# Altium schematic sheet Programmer.SchDoc
size A
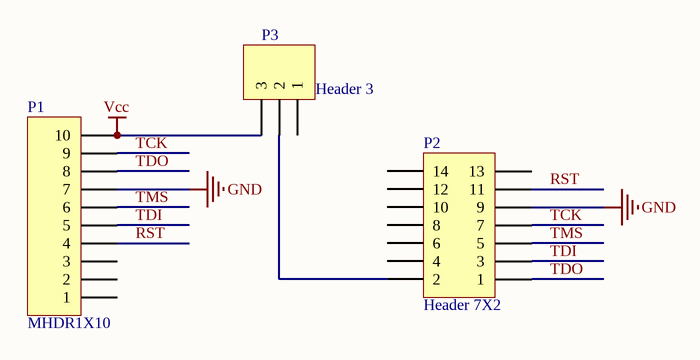
[diagram p0: Programmer.SchDoc]

## Parts
P1  MHDR1X10  [MHDR1X10]
P2  Header 7X2  [HDR2X7]
P3  Header 3  [HDR1X3]

## Nets
GND: P1.7 P2.9
Vcc: P1.10 P3.3
RST: P1.4 P2.11
TCK: P1.9 P2.7
TDI: P1.5 P2.3
TDO: P1.8 P2.1
TMS: P1.6 P2.5
NetP2_2: P2.2 P3.2

Not connected (* = marked no-connect by the designer): P1 1 2 3; P2 4 6 8 10 12 13 14; P3 1

## Library data of the parts
P1 = MHDR1X10: Header, 10-Pin; Manufacturer: Mill-Max Manufacturing Corp.; Part Number: 850-10-050-20-001000; Description: CONN HEADER RT ANG 50POS .050; Vendor: DigiKey; Price: $13.56/pcs; DataSheet Internet: http://www.mill-max.com/images/products/pdf/067N.PDF
P2 = Header 7X2: Header, 7-Pin, Dual row; Manufacturer: Molex Connector Corporation; Part Number: 90131-0767; Description: CONN HEADER 14POS .100" STR GOLD; Vendor: DigiKey; Price: $2.38/pcs; DataSheet Internt: http://www.molex.com/pdm_docs/sd/901310767_sd.pdf
P3 = Header 3: Header, 3-Pin; LatestRevisionDate: 17-Jul-2002; LatestRevisionNote: Re-released for DXP Platform.; Publisher: Altium Limited